# Altium project DTMF.PrjPCB
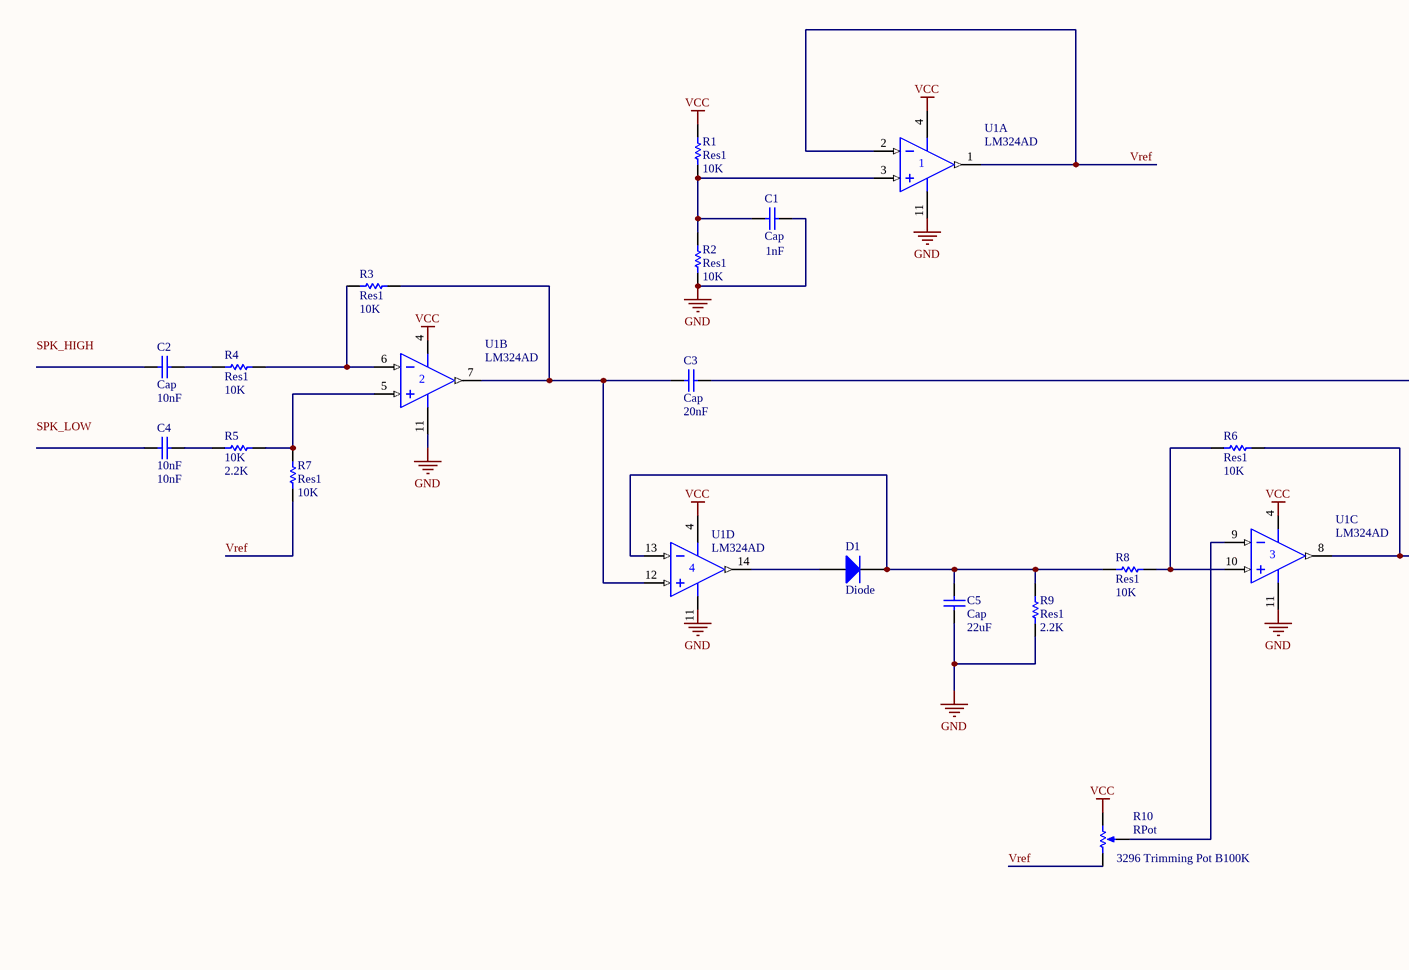
[diagram p0: ground station DTMF.SchDoc, left]
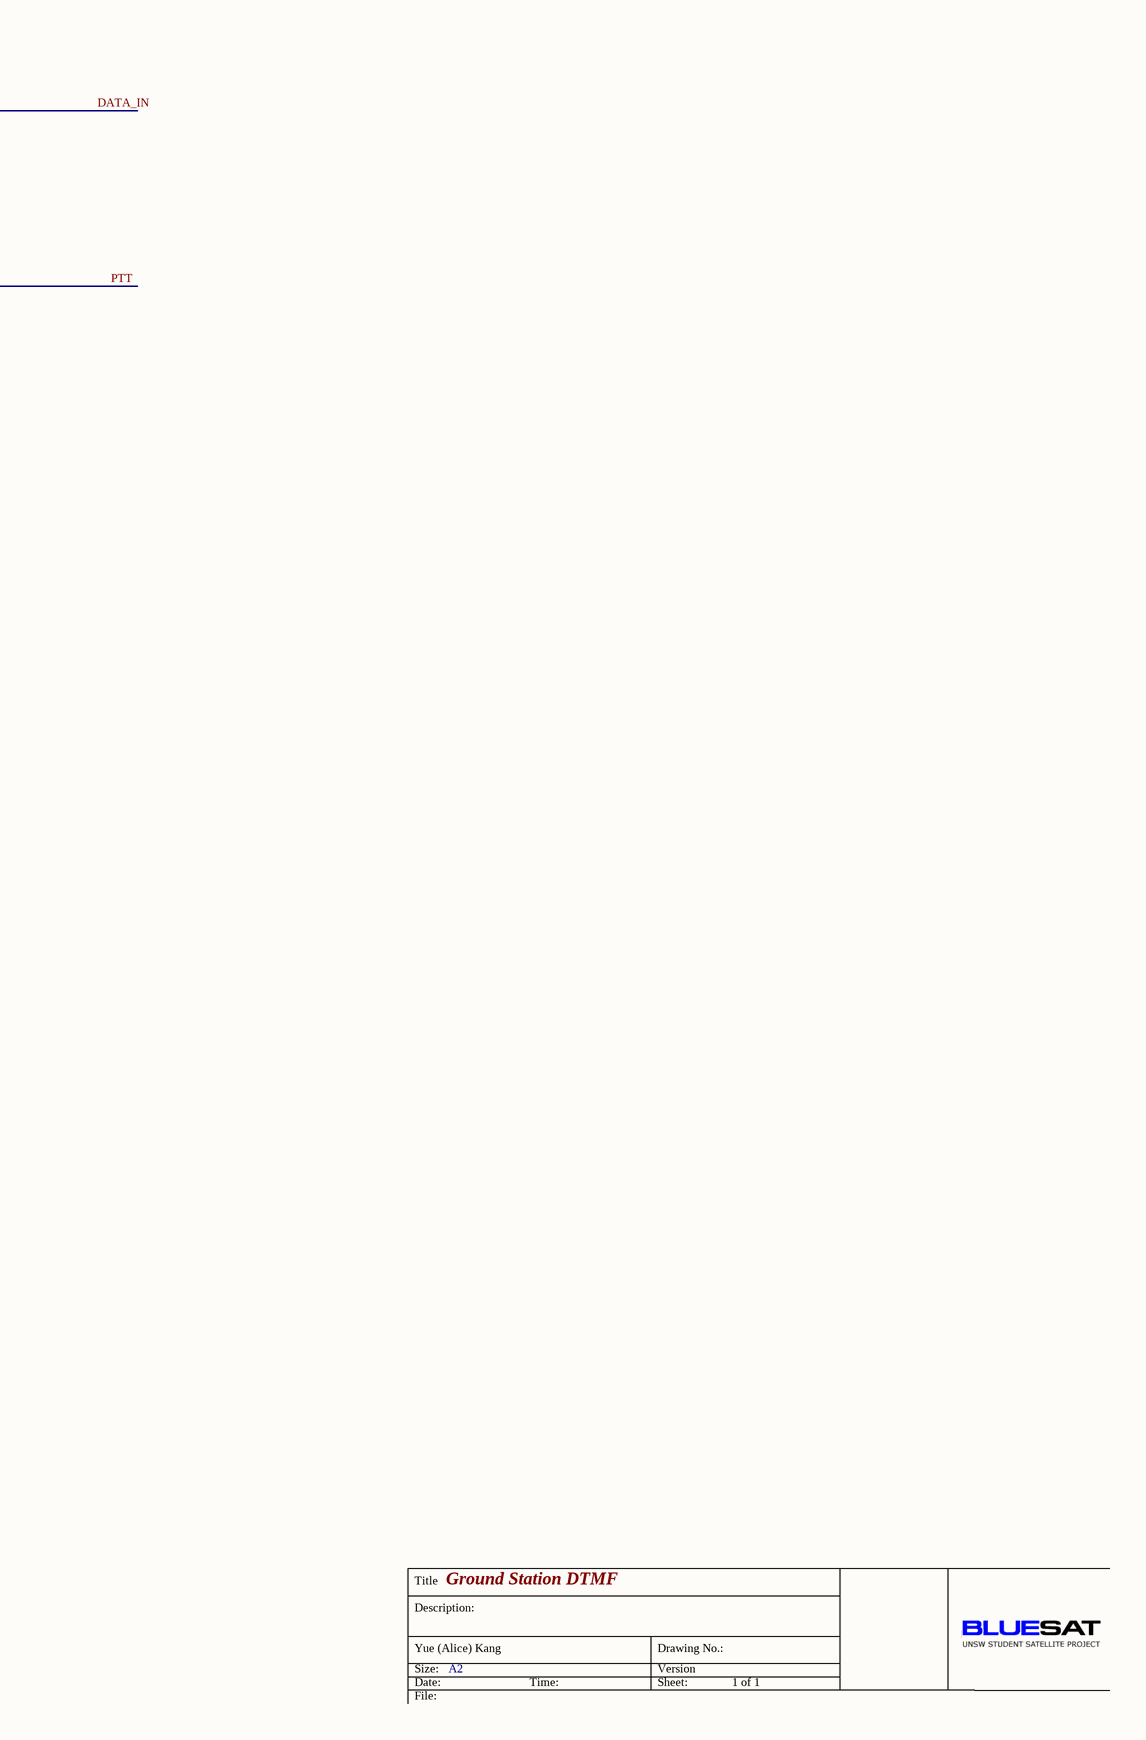
[diagram p1: ground station DTMF.SchDoc, right]
1 sheet, 17 parts. Net scope: global (net labels, ports and power ports of the same name join across sheets).
Board file: DTMF.PcbDoc

## Sheet ground station DTMF.SchDoc: Title Block Template
size A2; Engineer: M. BRINDLEY; Organization: BLUEsat Project; Address1: Room 419; Address2: School of EE&T; Address3: UNSW, NSW 2052; Address4: Australia; DocumentNumber: TITL0001; Version: 1.0

### Parts
C1  Cap  value 1nF  [0805_RES]
C2  Cap  value 10nF  [0805_RES]
C3  Cap  value 20nF  [0805_RES]
C4  10nF  [0805_RES]
C5  Cap  value 22uF  [0805_RES]
D1  Diode  [SMC]
R1  Res1  value 10K  [0805_RES]
R2  Res1  value 10K  [0805_RES]
R3  Res1  value 10K  [0805_RES]
R4  Res1  value 10K  [0805_RES]
R5  10K  value 2.2K  [0805_RES]
R6  Res1  value 10K  [0805_RES]
R7  Res1  value 10K  [0805_RES]
R8  Res1  value 10K  [0805_RES]
R9  Res1  value 2.2K  [0805_RES]
R10  RPot  3296 Square Trimming Pot: 3296 Trimming Pot B100K  [VR5]
U1  LM324AD  [SOIC127P600X175-14N]  (parts A,B,C,D of 4)

### Nets
GND: C1.2 C5.1 R2.1 R9.1 U1.11(V-)
VCC: R1.2 R10.2(BOT) U1.4(V+)
DATA_IN: C3.2
PTT: R6.2 U1.8(OUT)
Vref: R7.1 R10.1(TOP) U1.1(OUT) U1.2(IN-)
NetC1_1: C1.1 R1.1 R2.2 U1.3(IN+)
NetC2_2: C2.2 R4.1
NetC3_1: C3.1 R3.2 U1.7(OUT) U1.12(IN+)
NetC4_2: C4.2 R5.1
NetC5_2: C5.2 D1.2(K) R8.1 R9.2 U1.13(IN-)
NetD1_1: D1.1(A) U1.14(OUT)
NetR3_1: R3.1 R4.2 U1.6(IN-)
NetR5_2: R5.2 R7.2 U1.5(IN+)
NetR6_1: R6.1 R8.2 U1.10(IN+)
NetR10_3: R10.3(TAP) U1.9(IN-)

Not connected (* = marked no-connect by the designer): C2 1; C4 1

### Notes on the sheet
- Title
- Description:
- Ground Station DTMF
- Size:
- Yue (Alice) Kang
- Date:
- File:
- A2
- Time:
- Version
- Sheet:
- Drawing No.:
- 1 of 1
- Labels drawn without touching a wire or pin: GND, SPK_HIGH, SPK_LOW, VCC

### Library data of the parts
C1-C5 = Cap: Capacitor; Published: 8-Jun-2000; LatestRevisionDate: 17-Jul-2002; LatestRevisionNote: Re-released for DXP Platform.; PackageReference: RAD-0.3; Publisher: Altium Limited; PackageDescription: Radial Cap, Thru-Hole; 2 Leads; 0.3 in Pin Spacing
  C4: Value: 10nF
D1 = Diode: Default Diode; Published: 8-Jun-2000; LatestRevisionDate: 17-Jul-2002; LatestRevisionNote: Re-released for DXP Platform.; PackageVersion: Sep-1996; PackageReference: SMC; Publisher: Altium Limited; PackageDescription: DO-214-AB/SMC; 2 C-Bend Leads; Body 7.9 x 5.9 mm, inc. leads (LxW); Code_JEDEC: DO-214-AB
R1-R9 = Res1: Resistor; Published: 8-Jun-2000; LatestRevisionDate: 17-Jul-2002; LatestRevisionNote: Re-released for DXP Platform.; PackageReference: AXIAL-0.3; Publisher: Altium Limited; PackageDescription: Axial Device, Thru-Hole; 2 Leads; 0.3 in Pin Spacing
R10 = RPot: Potentiometer; Sim Note: Enter the Resistance value and the set point into parameter fields.; Set Position: 0.5; Published: 8-Jun-2000; LatestRevisionDate: 17-Jul-2002; LatestRevisionNote: Re-released for DXP Platform.; PackageReference: VR5; Publisher: Altium Limited; PackageDescription: Variable Resistor, Thru-Hole; 3 Leads
U1 = LM324AD: Quad Low-Power Operational Amplifier; Published: 17-Jul-2002; LatestRevisionDate: 13-Apr-2006; LatestRevisionNote: IPC-7351 Footprint Added.; DatasheetVersion: 1988; PackageVersion: 1991; PackageReference: 751A-02; Publisher: Altium Limited; PackageDescription: 14-Pin Small Outline Integrated Circuit 1.27 mm Pitch; Code_IPC: SOIC127P600-14; ComponentLink1Description: Manufacturer Link; ComponentLink1URL: http://www.onsemi.com/site/products/parametrics/0,4446,251,00.html; ComponentLink2Description: Datasheet; ComponentLink2URL: http://www.onsemi.com/pub/Collateral/LM324-D.PDF